# EasyEDA Pro project Output_Register.eprj

# Schematic Schematic1
Board Name: Board1; Create Date: 2025-08-19; Page Name: P1; Project Name: Output_Register; Schematic Name: Schematic1; Update Date: 2025-08-19; Company: EasyEDA.com; Page Size: A4; Version: V1.0
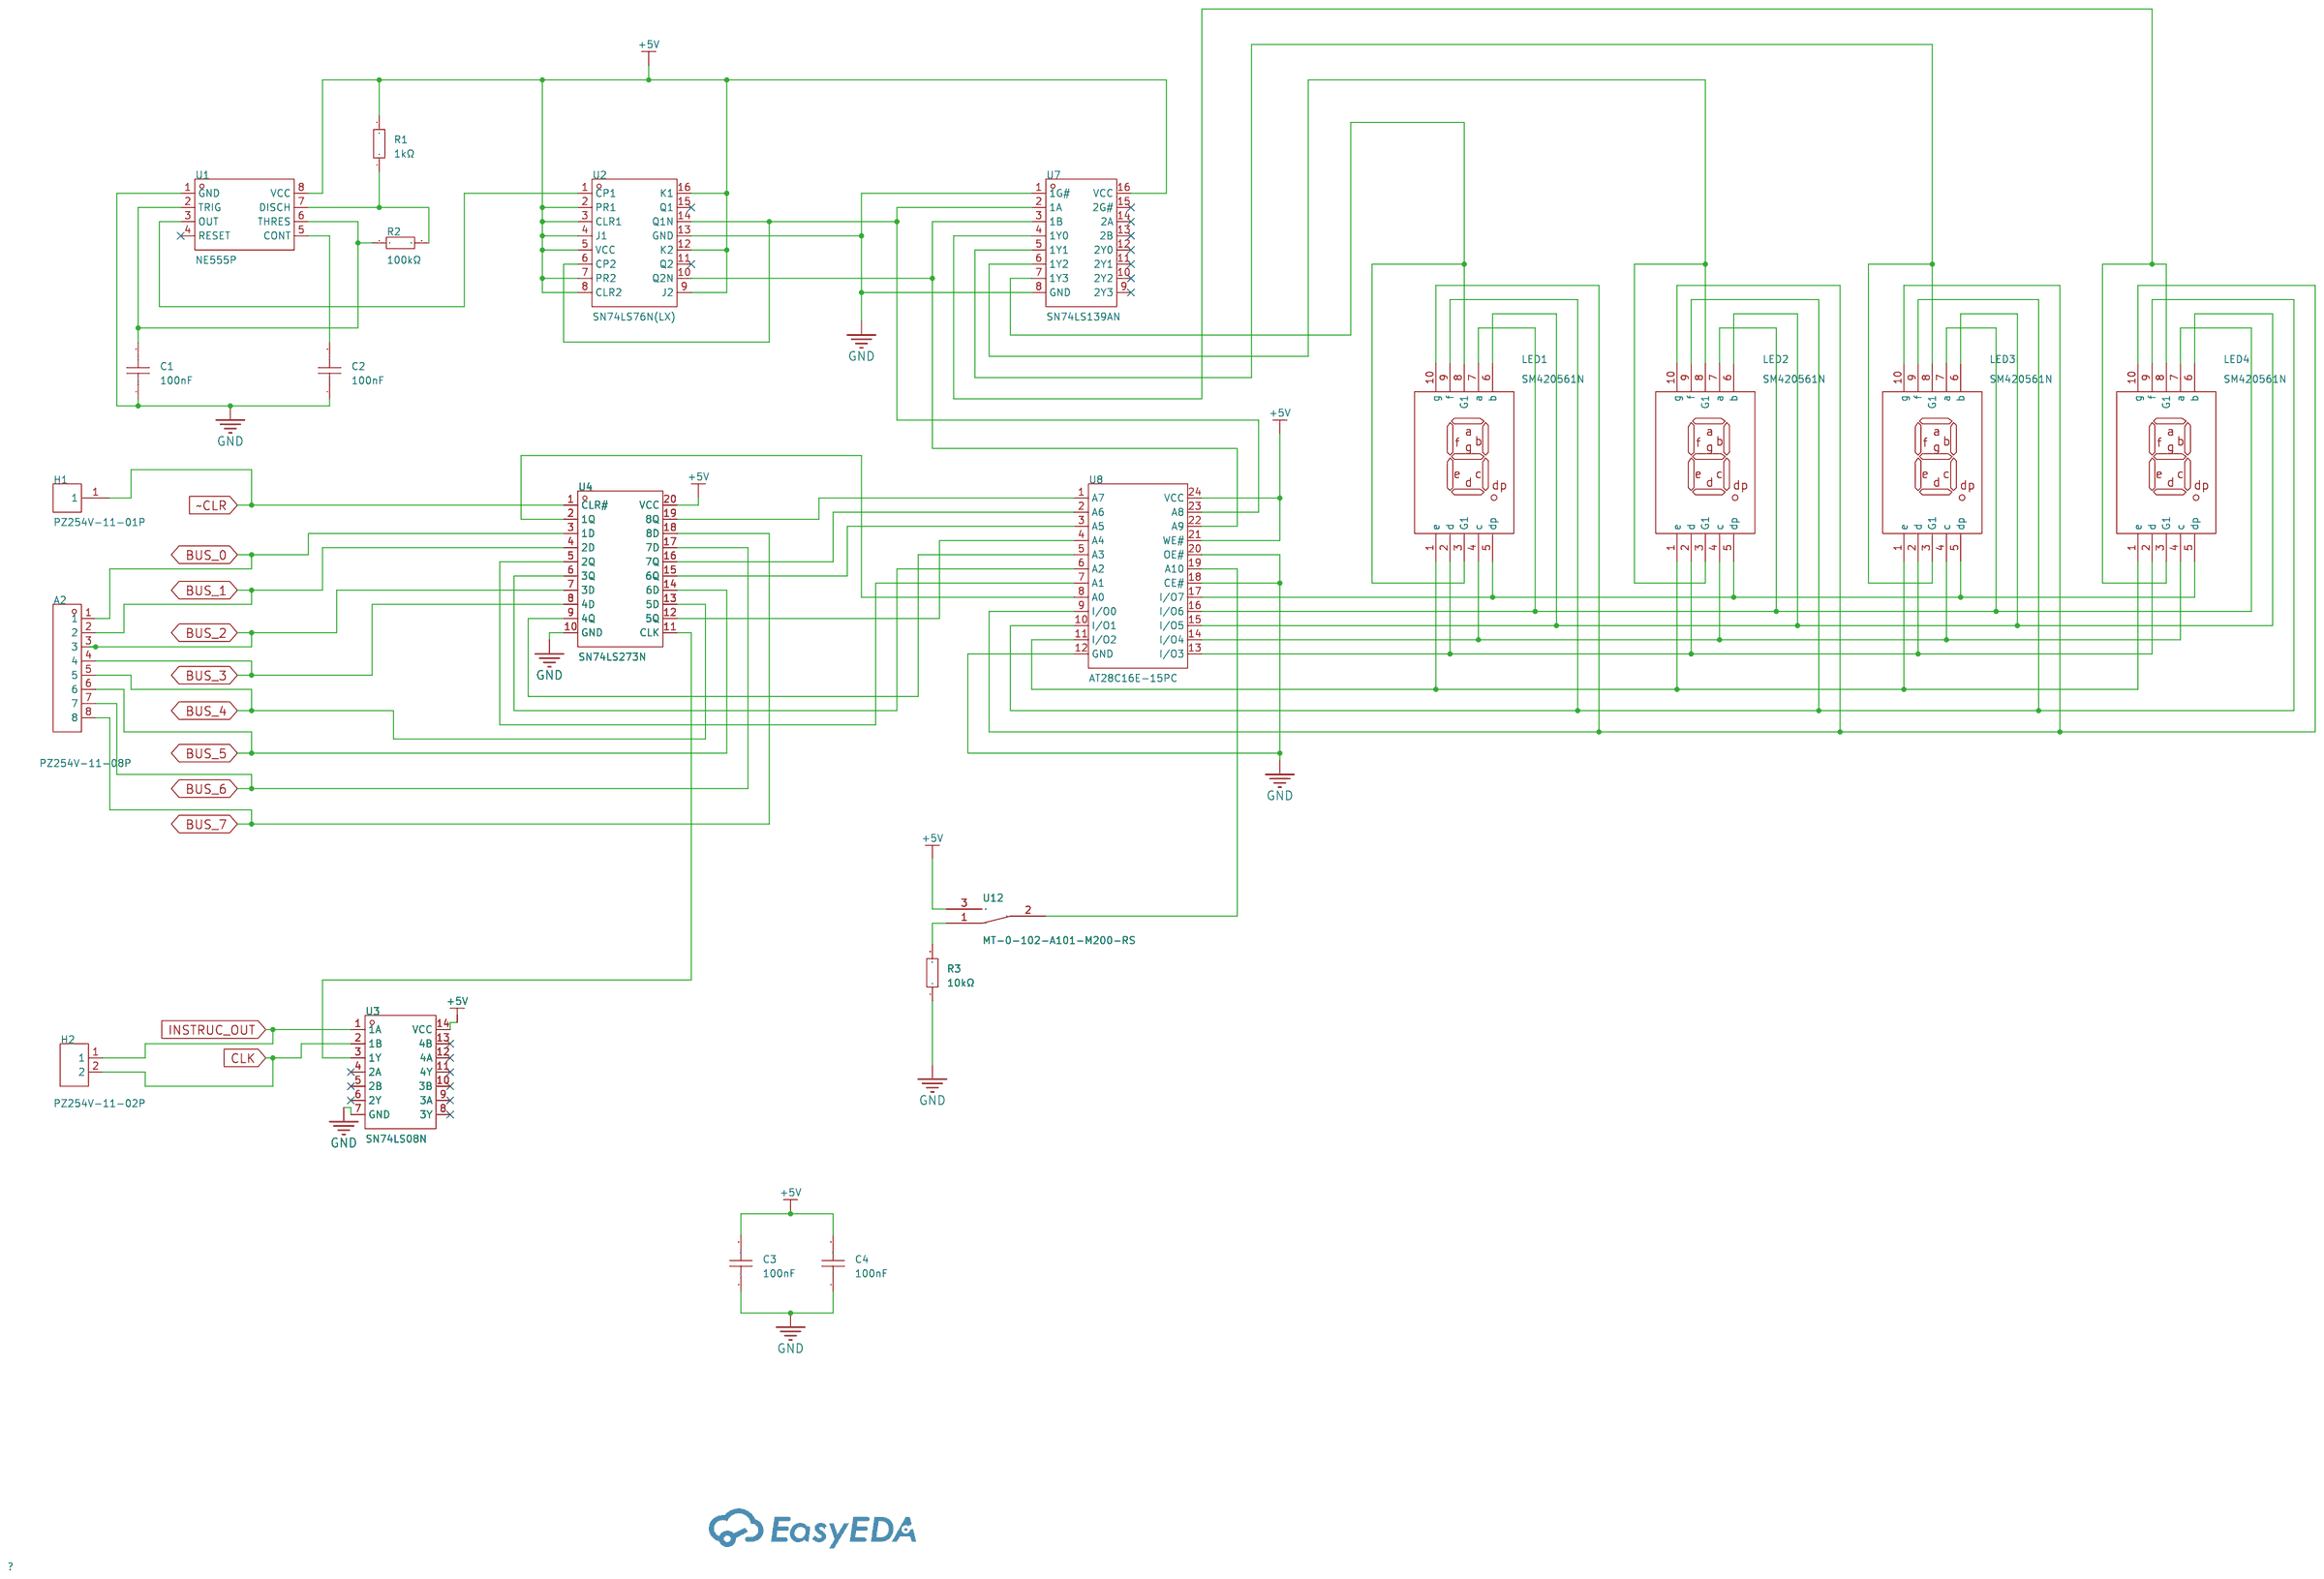
[diagram p0: schematic sheet]

## Parts
A2  PZ254V-11-08P  [HDR-TH_8P-P2.54-V-M]
C1  100nF  [CAP-TH_L8.5-W5.0-P5.00-D1.2]
C2  100nF  [CAP-TH_L8.5-W5.0-P5.00-D1.2]
C3  100nF  [CAP-TH_L8.5-W5.0-P5.00-D1.2]
C4  100nF  [CAP-TH_L8.5-W5.0-P5.00-D1.2]
H1  PZ254V-11-01P  [HDR-TH_1P-P2.54-V-M]
H2  PZ254V-11-02P  [HDR-TH_2P-P2.54-V-M]
LED1  SM420561N  [LED-SEG-TH_10P-L12.7-W19.0-P2.54-S15.24-BL]
LED2  SM420561N  [LED-SEG-TH_10P-L12.7-W19.0-P2.54-S15.24-BL]
LED3  SM420561N  [LED-SEG-TH_10P-L12.7-W19.0-P2.54-S15.24-BL]
LED4  SM420561N  [LED-SEG-TH_10P-L12.7-W19.0-P2.54-S15.24-BL]
R1  1kΩ  [R_AXIAL-0.4]
R2  100kΩ  [R_AXIAL-0.4]
R3  10kΩ  [R_AXIAL-0.4]
U1  NE555P  [DIP-8_L9.8-W6.6-P2.54-LS7.6-BL]
U2  SN74LS76N(LX)  [PDIP-16_L19.3-W6.4-P2.54-LS7.94-BL]
U3  SN74LS08N  [PDIP-14_L19.3-W6.4-P2.54-LS7.9-BL-1]
U4  SN74LS273N  [PDIP-20_L25.4-W6.4-P2.54-LS7.6-BL]
U7  SN74LS139AN  [PDIP-16_L19.3-W6.4-P2.54-LS7.9-BL]
U8  AT28C16E-15PC  [PDIP-24_L31.0-W13.5-P2.54-LS15.2-BL]
U12  MT-0-102-A101-M200-RS  [SW-TH_MT-0-103-A101-M200-RS]

## Library data of the parts
A2 = PZ254V-11-08P: Pin Structure:1x8P Pitch:2.54mm Row Spacing:- Circluar Pins/Square Pins:Square Pins Mounting Type:Straight Number of Rows:Plugin Number of Pins:8P Current Rating (Max):- Voltage Rating (Max):- Length of Mating Pin:6mm Insulation Height:2.5mm Length of End; LCSC Part Name: 间距:2.54mm 1x8P 直插 方针; Supplier Part: C492407; Manufacturer: XFCN(兴飞); Supplier Footprint: 插件,P=2.54mm; JLCPCB Part Class: Extended Part; Datasheet: https://atta.szlcsc.com/upload/public/pdf/source/20200309/C492407_83A6FB26A2233368EDB9516968EC6149.pdf; Supplier: LCSC; Pin Structure: 1x8P; Pitch: 2.54mm; Circluar Pins/Square Pins: Square Pins; Mounting Type: Straight; Number of Rows: Plugin; Number of Pins: 8P; Length of Mating Pin: 6mm; Insulation Height: 2.5mm; Length of End Connection Pin: 3mm; Operating Temperature Range: -40℃~+105℃; Color: Black
C1-C4 = CT4-0805B104K500F3: Capacitance:100nF Tolerance:±10% Tolerance:±10% Voltage Rated: Temperature Coefficient:; LCSC Part Name: 100nF ±10% 50V C3型（直脚）; Supplier Part: C84772; Manufacturer: FH(风华); Supplier Footprint: 插件,P=5.08mm; JLCPCB Part Class: Extended Part; Datasheet: https://atta.szlcsc.com/upload/public/pdf/source/20190402/C385200_059806A6312B28FF1421A2413EB641E1.pdf; Supplier: LCSC; Tolerance: ±10%
H1 = PZ254V-11-01P: Pin Structure:1x1P Pitch:2.54mm Row Spacing:- Circluar Pins/Square Pins:Policy Mounting Type:Straight Number of Rows:Single Row Number of Pins:1P Current Rating:- Voltage Rating (Max):- Length of Mating Pin:6mm Insulation Height:2.5mm Length of End Connec; LCSC Part Name: 1x1P 间距:2.54mm 方针 直插; Supplier Part: C492400; Manufacturer: XFCN(兴飞); Supplier Footprint: 插件,P=2.54mm; JLCPCB Part Class: Extended Part; Datasheet: https://atta.szlcsc.com/upload/public/pdf/source/20200309/C492400_46876A5B545F5AE6B8D4A09C46E276E8.pdf; Supplier: LCSC; Pin Structure: 1x1P; Pitch: 2.54mm; Circluar Pins/Square Pins: Policy; Mounting Type: Straight; Number of Rows: Single Row; Number of Pins: 1P; Length of Mating Pin: 6mm; Insulation Height: 2.5mm; Length of End Connection Pin: 3mm; Contact Material: Brass; Operating Temperature: -40℃~+105℃; Color: Black
H2 = PZ254V-11-02P: Pin Structure:1x2P Pitch:2.54mm Row Spacing:- Circluar Pins/Square Pins:Policy Mounting Type:Straight Number of Rows:Single Row Number of Pins:2P Current Rating:- Voltage Rating (Max):- Length of Mating Pin:6mm Insulation Height:2.5mm Length of End Connec; LCSC Part Name: 1x2P 间距:2.54mm 方针 直插; Supplier Part: C492401; Manufacturer: XFCN(兴飞); Supplier Footprint: 插件,P=2.54mm; JLCPCB Part Class: Extended Part; Datasheet: https://atta.szlcsc.com/upload/public/pdf/source/20200309/C492401_A812433581A9B211A7FFA413ADDFF0E5.pdf; Supplier: LCSC; Pin Structure: 1x2P; Pitch: 2.54mm; Circluar Pins/Square Pins: Policy; Mounting Type: Straight; Number of Rows: Single Row; Number of Pins: 2P; Length of Mating Pin: 6mm; Insulation Height: 2.5mm; Length of End Connection Pin: 3mm; Contact Material: Brass; Operating Temperature: -40℃~+105℃; Color: Black
LED1-LED4 = SM420561N: Number of Characters:1Bit Display Type:7段 Module Size:19mmx12.6mmx8mm Power Dissipation:50mW Luminous Color:Red LED Polarity:共阴极 Digit/Alpha Size(inch):0.56; LCSC Part Name: 1位0.56英寸红色数码管 共阴极; Supplier Part: C141367; Manufacturer: ARKLED(方舟); Supplier Footprint: 插件; JLCPCB Part Class: Extended Part; Datasheet: https://atta.szlcsc.com/upload/public/pdf/source/20171116/C141367_15108221483041123770.pdf; Supplier: LCSC; Number of Characters: 1Bit; Display Type: 7段; Module Size: 19mmx12.6mmx8mm; Power Dissipation: 50mW; Luminous Color: Red; LED Polarity: 共阴极; Digit/Alpha Size(inch): 0.56
R1-R3 = Res_AXIAL-1/4W: Supplier Footprint: Through
U1 = NE555P: Supplier Part: C46749; Manufacturer: TI(德州仪器); Supplier Footprint: DIP-8; JLCPCB Part Class: Extended Part; Datasheet: https://www.ti.com/cn/lit/gpn/ne555; Supplier: LCSC
U2 = SN74LS76N(LX): Type:JK-Type Trigger Type:Falling Edge Voltage - Supply:2V~6V Voltage - Supply:2V~6V Clock Frequency:28MHz Output Type:Push-Pull Propagation Delay:- Series:74LS Series Quiescent Current:2uA Operating Temperature:-40℃~+125℃ Operating Temperature:-40℃~+125℃; Supplier Part: C41432856; Manufacturer: LX(灵星芯微); Supplier Footprint: DIP-16; Datasheet: https://atta.szlcsc.com/upload/public/pdf/source/20241021/03E57047579D06EC809D279D7674BE8E.pdf; Supplier: LCSC; Type: JK-Type; Trigger Type: Falling Edge; Voltage - Supply: 2V~6V; Clock Frequency: 28MHz; Output Type: Push-Pull; Series: 74LS Series; Quiescent Current: 2uA; Operating Temperature: -40℃~+125℃
U3 = SN74LS08N: Logic Type:AND Gate Number of Channels:4 Voltage - Supply:4.75V~5.25V Voltage - Supply:4.75V~5.25V Current - Output Low(IOL):8mA Current - Output High(IOH):400uA Input Logic Level - High:2V Input Logic Level - High:2V Input Logic Level - Low:800mV Input L; Supplier Part: C2869595; Manufacturer: TI(德州仪器); Supplier Footprint: PDIP-14; JLCPCB Part Class: Extended Part; Datasheet: https://www.ti.com/cn/lit/gpn/sn54s08; Supplier: LCSC; Logic Type: AND Gate; Number of Channels: 4; Voltage - Supply: 4.75V~5.25V; Current - Output Low(IOL): 8mA; Current - Output High(IOH): 400uA; Input Logic Level - High: 2V; Input Logic Level - Low: 800mV; Series: 74LSSeries; Operating Temperature: 0℃~+70℃
U4 = SN74LS273N: Type:D-Type Trigger Type:Rising Edge Voltage - Supply:4.75V~5.25V Voltage - Supply:4.75V~5.25V Clock Frequency:40MHz Function:Reset Number of Elements:1 Number of Bits per Element:8 Output Type:- Propagation Delay:27ns@5V,15pF Series:74LS Series Current -; Supplier Part: C2879026; Manufacturer: TI(德州仪器); Supplier Footprint: PDIP-20; JLCPCB Part Class: Extended Part; Datasheet: https://www.ti.com/cn/lit/gpn/sn54ls273; Supplier: LCSC; Type: D-Type; Trigger Type: Rising Edge; Voltage - Supply: 4.75V~5.25V; Clock Frequency: 40MHz; Function: Reset; Number of Elements: 1; Number of Bits per Element: 8; Propagation Delay: 27ns@5V,15pF; Series: 74LS Series; Current - Output Low(IOL): 8mA; Current - Output High(IOH): 400uA; Quiescent Current: 27mA; Operating Temperature: 0℃~+70℃
U7 = SN74LS139AN: Type:Decoder/Demultiplexer Voltage Supply Source:Single Supply Voltage - Supply:4.75V~5.25V Voltage - Supply:4.75V~5.25V Current - Output Low(IOL):8mA Current - Output High(IOH):400uA Operating temperature:0℃~+70℃ Operating temperature:0℃~+70℃; Supplier Part: C1547281; Manufacturer: TI(德州仪器); Supplier Footprint: PDIP-16; JLCPCB Part Class: Extended Part; Datasheet: https://www.ti.com/cn/lit/gpn/sn74ls139a; Supplier: LCSC; Type: Decoder/Demultiplexer; Voltage Supply Source: Single Supply; Voltage - Supply: 4.75V~5.25V; Current - Output Low(IOL): 8mA; Current - Output High(IOH): 400uA; Operating temperature: 0℃~+70℃
U8 = AT28C16E-15PC: Supplier Part: C19393057; Manufacturer: MICROCHIP(美国微芯); Supplier Footprint: PDIP-24; JLCPCB Part Class: Extended Part; Datasheet: https://atta.szlcsc.com/upload/public/pdf/source/20231219/98B154FA288F53C07025EE50A49045E4.pdf; Supplier: LCSC
U12 = MT-0-102-A101-M200-RS: Circuit:Single Pole Double Throw (SPDT) Switch Length:13mm Switch Width:8mm Switch Height:28.6mm Mechanical Life:- Contact Current:5A Voltage Rating (AC):125V Actuator Type:Cylinder knob Pin Style:Solder Mounting Style:Direct Insert Operating Temperature:; LCSC Part Name: 小型钮子三脚二档 五件套; Supplier Part: C1788492; Manufacturer: YUEN FUNG(源丰); Supplier Footprint: 插件; JLCPCB Part Class: Extended Part; Datasheet: https://atta.szlcsc.com/upload/public/pdf/source/20230720/8E5C36EFDF374AE4FF4AC09DB233CE0E.pdf; Supplier: LCSC; Circuit: Single Pole Double Throw (SPDT); Switch Length: 13mm; Switch Width: 8mm; Switch Height: 28.6mm; Contact Current: 5A; Voltage Rating (AC): 125V; Actuator Type: Cylinder knob; Pin Style: Solder; Mounting Style: Direct Insert; Operating Temperature: -25℃~+85℃

## Nets
+5V: C3.2 C4.2 R1.2 U1.8(VCC) U2.2(PR1) U2.3(CLR1) U2.4(J1) U2.5(VCC) U2.7(PR2) U2.8(CLR2) U2.9(J2) U2.12(K2) U2.16(K1) U3.14(VCC) U4.20(VCC) U7.16(VCC) U8.21(WE#) U8.24(VCC) U12.3
GND: C1.1 C2.1 C3.1 C4.1 R3.1 U1.1(GND) U2.13(GND) U3.7(GND) U4.10(GND) U7.1(1G#) U7.8(GND) U8.12(GND) U8.18(CE#) U8.20(OE#)
BUS_0: A2.1 U4.3(1D)
BUS_1: A2.2 U4.4(2D)
BUS_2: A2.3 U4.7(3D)
BUS_3: A2.4 U4.8(4D)
BUS_4: A2.5 U4.13(5D)
BUS_5: A2.6 U4.14(6D)
BUS_6: A2.7 U4.17(7D)
BUS_7: A2.8 U4.18(8D)
CLK: H2.2 U3.2(1B)
INSTRUC_OUT: H2.1 U3.1(1A)
~CLR: H1.1 U4.1(CLR#)
$1N1467: C2.2 U1.5(CONT)
$1N1468: C1.2 R2.1 U1.2(TRIG) U1.6(THRES)
$1N1469: R1.1 R2.2 U1.7(DISCH)
$1N1471: U1.3(OUT) U2.1(CP1)
$1N1472: U2.10(Q2N) U7.3(1B) U8.22(A9)
$1N1473: U2.6(CP2) U2.14(Q1N) U7.2(1A) U8.23(A8)
$1N1480: U3.3(1Y) U4.11(CLK)
$1N1483: U4.2(1Q) U8.8(A0)
$1N1484: U4.5(2Q) U8.7(A1)
$1N1485: U4.6(3Q) U8.6(A2)
$1N1486: U4.9(4Q) U8.5(A3)
$1N1487: U4.12(5Q) U8.4(A4)
$1N1488: U4.15(6Q) U8.3(A5)
$1N1489: U4.16(7Q) U8.2(A6)
$1N1490: U4.19(8Q) U8.1(A7)
$1N1495: LED1.10(g) LED2.10(g) LED3.10(g) LED4.10(g) U8.9(I/O0)
$1N1496: LED1.9(f) LED2.9(f) LED3.9(f) LED4.9(f) U8.10(I/O1)
$1N1497: LED1.1(e) LED2.1(e) LED3.1(e) LED4.1(e) U8.11(I/O2)
$1N1498: LED1.2(d) LED2.2(d) LED3.2(d) LED4.2(d) U8.13(I/O3)
$1N1499: LED1.4(c) LED2.4(c) LED3.4(c) LED4.4(c) U8.14(I/O4)
$1N1500: LED1.6(b) LED2.6(b) LED3.6(b) LED4.6(b) U8.15(I/O5)
$1N1501: LED1.7(a) LED2.7(a) LED3.7(a) LED4.7(a) U8.16(I/O6)
$1N1502: LED1.5(dp) LED2.5(dp) LED3.5(dp) LED4.5(dp) U8.17(I/O7)
$1N1503: LED3.3(G1) LED3.8(G1) U7.5(1Y1)
$1N1504: LED2.3(G1) LED2.8(G1) U7.6(1Y2)
$1N1505: LED1.3(G1) LED1.8(G1) U7.7(1Y3)
$1N1506: LED4.3(G1) LED4.8(G1) U7.4(1Y0)
$1N1511: R3.2 U12.1
$1N1512: U8.19(A10) U12.2

Not connected (* = marked no-connect by the designer): U1 4(RESET)*; U2 11(Q2)* 15(Q1)*; U3 4(2A)* 5(2B)* 6(2Y)* 8(3Y)* 9(3A)* 10(3B)* 11(4Y)* 12(4A)* 13(4B)*; U7 9(2Y3)* 10(2Y2)* 11(2Y1)* 12(2Y0)* 13(2B)* 14(2A)* 15(2G#)*

# Board PCB1
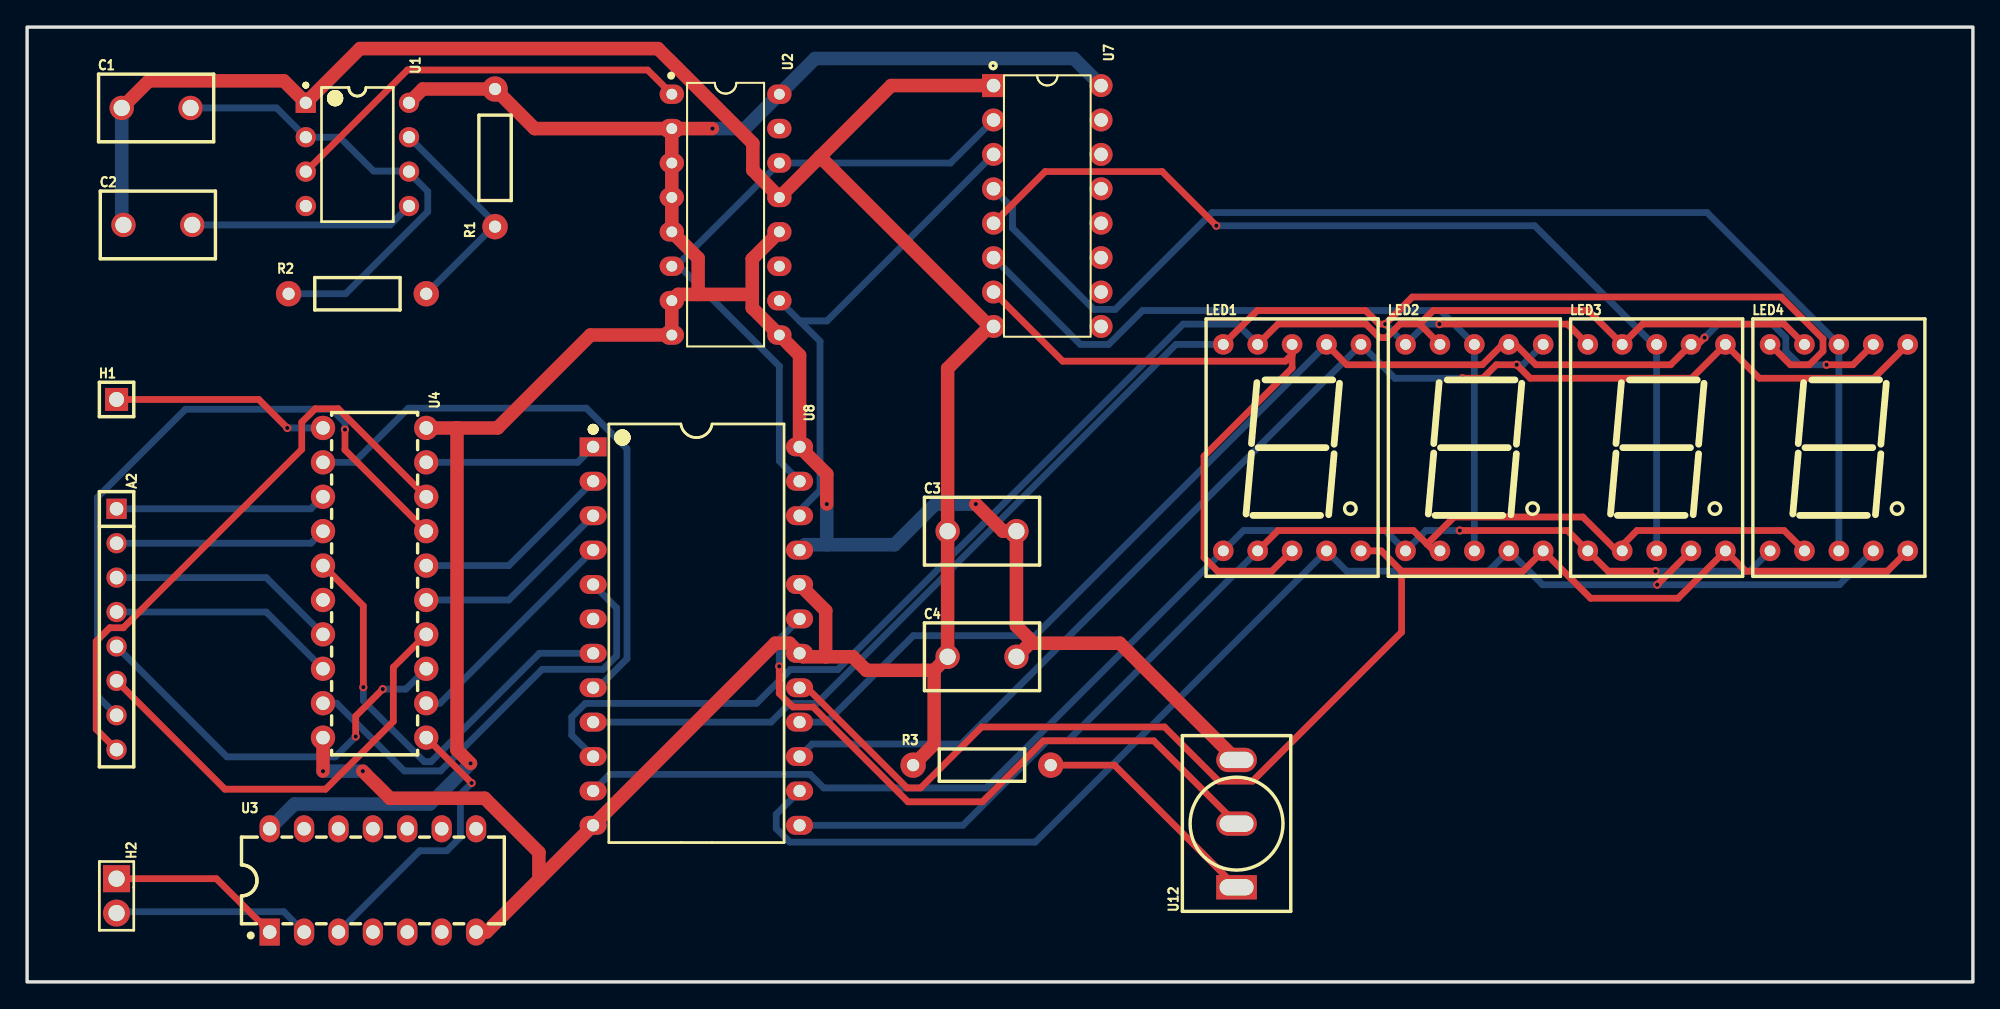
[diagram p1: board, top side]
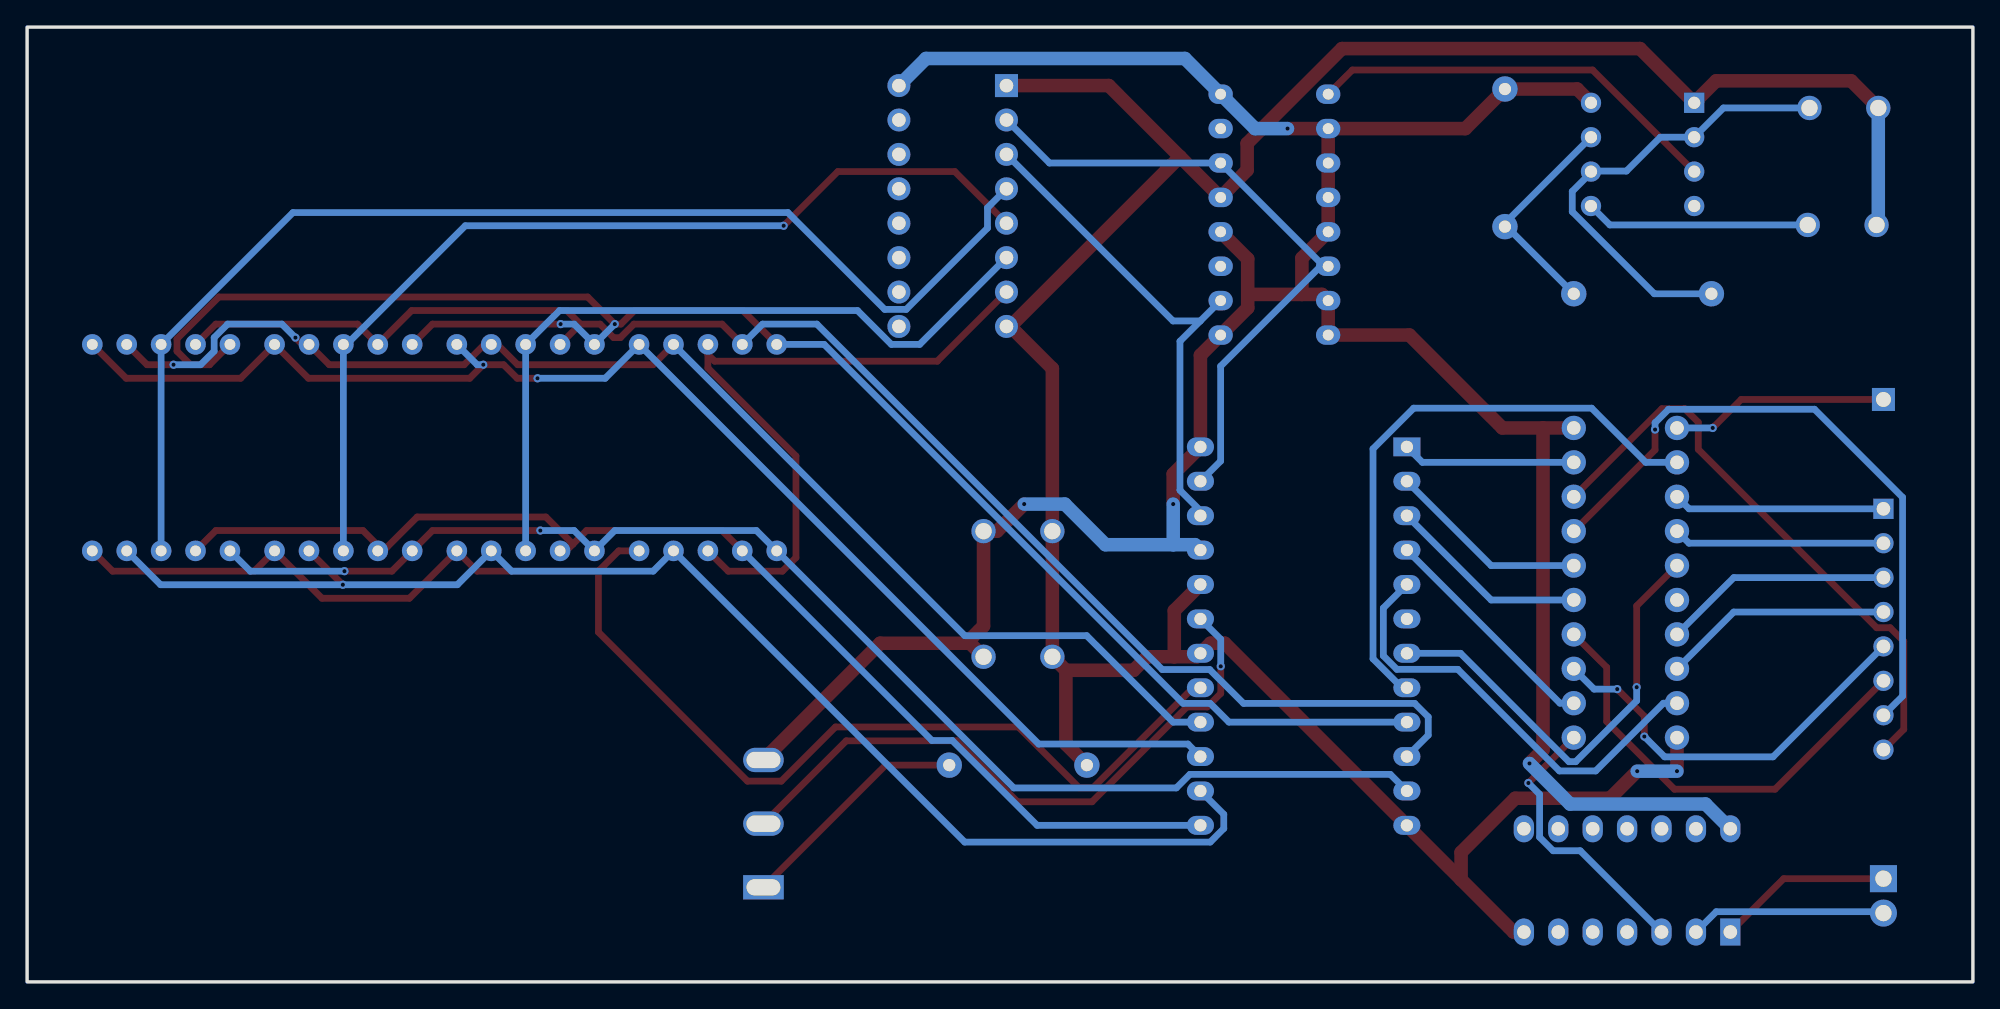
[diagram p2: board, bottom side, seen from below]

Outline 143.64 x 70.48 mm; copper layers: Top Layer, Bottom Layer. Coordinates in mm from the lower left corner of the outline.
Outline path: rectangle 0,70.48 143.64,0
Stack: Top Layer 0.035mm / Dielectric1 1.51mm FR4 er 4.5 / Bottom Layer 0.035mm

## Design rules (mm)
template: Custom Config
spacing copperThickness1oz (default): track to track 0.102, other pairs 0.152 to 0.3
spacing copperThickness2oz: track to track 0.203, other pairs 0.152 to 0.3
track width copperThickness1oz (default): min 0.127, default 0.5, max 2.54
track width copperThickness2oz: min 0.203, default 1, max 2.54
differential pair differentialPair (default): width min 0.127, default 0.254, max 2.54; gap min 0.152, default 0.152
via viaSize (default): diameter min 0.5, default 0.61, max 10; hole min 0.3, default 0.305, max 6.3
net GND uses copperThickness2oz
net +5V uses copperThickness2oz

## Placement (name value [footprint] x y rotation side)
A2  PZ254V-11-08P  [HDR-TH_8P-P2.54-V-M]  6.6 26.04 270 top
C1  100nF  [CAP-TH_L8.5-W5.0-P5.00-D1.2]  9.53 64.52 0 top
C2  100nF  [CAP-TH_L8.5-W5.0-P5.00-D1.2]  9.65 55.88 0 top
C3  100nF  [CAP-TH_L8.5-W5.0-P5.00-D1.2]  70.49 33.27 0 top
C4  100nF  [CAP-TH_L8.5-W5.0-P5.00-D1.2]  70.49 24 0 top
H1  PZ254V-11-01P  [HDR-TH_1P-P2.54-V-M]  6.6 43 0 top
H2  PZ254V-11-02P  [HDR-TH_2P-P2.54-V-M]  6.6 6.35 270 top
LED1  SM420561N  [LED-SEG-TH_10P-L12.7-W19.0-P2.54-S15.24-BL]  93.38 39.44 0 top
LED2  SM420561N  [LED-SEG-TH_10P-L12.7-W19.0-P2.54-S15.24-BL]  106.83 39.44 0 top
LED3  SM420561N  [LED-SEG-TH_10P-L12.7-W19.0-P2.54-S15.24-BL]  120.29 39.44 0 top
LED4  SM420561N  [LED-SEG-TH_10P-L12.7-W19.0-P2.54-S15.24-BL]  133.74 39.44 0 top
R1  1kΩ  [R_AXIAL-0.4]  34.54 60.83 90 top
R2  100kΩ  [R_AXIAL-0.4]  24.38 50.8 0 top
R3  10kΩ  [R_AXIAL-0.4]  70.48 16 0 top
U1  NE555P  [DIP-8_L9.8-W6.6-P2.54-LS7.6-BL]  24.38 61.09 270 top
U2  SN74LS76N(LX)  [PDIP-16_L19.3-W6.4-P2.54-LS7.94-BL]  51.56 56.64 270 top
U3  SN74LS08N  [PDIP-14_L19.3-W6.4-P2.54-LS7.9-BL-1]  25.53 7.49 0 top
U4  SN74LS273N  [PDIP-20_L25.4-W6.4-P2.54-LS7.6-BL]  25.65 29.46 270 top
U7  SN74LS139AN  [PDIP-16_L19.3-W6.4-P2.54-LS7.9-BL]  75.31 57.28 270 top
U8  AT28C16E-15PC  [PDIP-24_L31.0-W13.5-P2.54-LS15.2-BL]  49.4 25.53 270 top
U12  MT-0-102-A101-M200-RS  [SW-TH_MT-0-103-A101-M200-RS]  89.28 11.68 90 top

## Footprints (pads in the part's own frame, mm; a bottom-side part is the same pattern mirrored in y, then rotated)
CAP-TH_L8.5-W5.0-P5.00-D1.2
  round 1.8 hole 1.2: 1(-2.54,0) 2(2.54,0)
DIP-8_L9.8-W6.6-P2.54-LS7.6-BL
  rect 1.5x1.5 hole 0.9: 1(-3.81,-3.81)
  round 1.5 hole 0.9: 2(-1.27,-3.81) 3(1.27,-3.81) 4(3.81,-3.81) 5(3.81,3.81) 6(1.27,3.81) 7(-1.27,3.81) 8(-3.81,3.81)
HDR-TH_1P-P2.54-V-M
  rect 1.7x1.7 hole 1.1: 1(0,0)
HDR-TH_2P-P2.54-V-M
  rect 2x2 hole 1.2: 1(-1.27,0)
  round 2 hole 1.2: 2(1.27,0)
HDR-TH_8P-P2.54-V-M
  rect 1.5x1.5 hole 1: 1(-8.89,0)
  round 1.5 hole 1: 2(-6.35,0) 3(-3.81,0) 4(-1.27,0) 5(1.27,0) 6(3.81,0) 7(6.35,0) 8(8.89,0)
LED-SEG-TH_10P-L12.7-W19.0-P2.54-S15.24-BL
  round 1.524 hole 0.8: 1(-5.08,-7.62) 2(-2.54,-7.62) 3(0,-7.62) 4(2.54,-7.62) 5(5.08,-7.62) 6(5.08,7.62) 7(2.54,7.62) 8(0,7.62) 9(-2.54,7.62) 10(-5.08,7.62)
PDIP-14_L19.3-W6.4-P2.54-LS7.9-BL-1
  rect 1.5x2 hole 1: 1(-7.62,-3.809)
  oval 1.5x2 hole 1: 2(-5.08,-3.81) 3(-2.54,-3.81) 4(0,-3.81) 5(2.54,-3.81) 6(5.08,-3.81) 7(7.62,-3.81) 8(7.62,3.81) 9(5.08,3.81) 10(2.54,3.81) 11(0,3.81) 12(-2.54,3.81) 13(-5.08,3.81) 14(-7.62,3.81)
PDIP-16_L19.3-W6.4-P2.54-LS7.9-BL
  rect 1.7x1.7 hole 1: 1(-8.89,-3.97)
  round 1.7 hole 1: 2(-6.35,-3.97) 3(-3.81,-3.97) 4(-1.27,-3.97) 5(1.27,-3.97) 6(3.81,-3.97) 7(6.35,-3.97) 8(8.89,-3.97) 9(8.89,3.97) 10(6.35,3.97) 11(3.81,3.97) 12(1.27,3.97) 13(-1.27,3.97) 14(-3.81,3.97) 15(-6.35,3.97) 16(-8.89,3.97)
PDIP-16_L19.3-W6.4-P2.54-LS7.94-BL
  oval 1.44x1.8 hole 0.8: 1(-8.89,-3.97) 2(-6.35,-3.97) 3(-3.81,-3.97) 4(-1.27,-3.97) 5(1.27,-3.97) 6(3.81,-3.97) 7(6.35,-3.97) 8(8.89,-3.97) 9(8.89,3.97) 10(6.35,3.97) 11(3.81,3.97) 12(1.27,3.97) 13(-1.27,3.97) 14(-3.81,3.97) 15(-6.35,3.97) 16(-8.89,3.97)
PDIP-20_L25.4-W6.4-P2.54-LS7.6-BL
  round 1.8 hole 1: 1(-11.43,-3.81) 2(-8.89,-3.81) 3(-6.35,-3.81) 4(-3.81,-3.81) 5(-1.27,-3.81) 6(1.27,-3.81) 7(3.81,-3.81) 8(6.35,-3.81) 9(8.89,-3.81) 10(11.43,-3.81) 11(11.43,3.81) 12(8.89,3.81) 13(6.35,3.81) 14(3.81,3.81) 15(1.27,3.81) 16(-1.27,3.81) 17(-3.81,3.81) 18(-6.35,3.81) 19(-8.89,3.81) 20(-11.43,3.81)
PDIP-24_L31.0-W13.5-P2.54-LS15.2-BL
  rect 1.4x2 hole 0.9: 1(-13.97,-7.62)
  oval 1.4x2 hole 0.9: 2(-11.43,-7.62) 3(-8.89,-7.62) 4(-6.35,-7.62) 5(-3.81,-7.62) 6(-1.27,-7.62) 7(1.27,-7.62) 8(3.81,-7.62) 9(6.35,-7.62) 10(8.89,-7.62) 11(11.43,-7.62) 12(13.97,-7.62) 13(13.97,7.62) 14(11.43,7.62) 15(8.89,7.62) 16(6.35,7.62) 17(3.81,7.62) 18(1.27,7.62) 19(-1.27,7.62) 20(-3.81,7.62) 21(-6.35,7.62) 22(-8.89,7.62) 23(-11.43,7.62) 24(-13.97,7.62)
R_AXIAL-0.4
  round 1.879 hole 0.899: 1(-5.08,0) 2(5.08,0)
SW-TH_MT-0-103-A101-M200-RS
  rect 1.8x3 hole 1.2x2.5: 1(-4.7,0)
  oval 1.8x3 hole 1.2x2.5: 2(0,0) 3(4.7,0)

## Nets
As in the schematic.

Pads without a net: U1 4; U2 11 15; U3 4 5 6 8 9 10 11 12 13; U7 9 10 11 12 13 14 15

## Via types
v1: diameter 0.61, hole 0.305, Top Layer to Bottom Layer, 23 vias

## Routing (per net, layer and track width the routed paths; a pad name or vN(x,y) marks a point on that pad's centre or on a via; arc(x,y) is an arc through that point)
+5V: length 213.7
  Top Layer w1: 49.53,50.75 49.53,53.43 47.59,55.37 U2.4 U2.3 U2.2 ; 49.53,50.75 48.05,50.75 47.59,50.29 U2.8 41.59,47.75 34.73,40.89 31.73,40.89 ; 49.53,50.75 53.53,50.75 ; v1(32.73,16.13) 31.73,17.13 31.73,40.89 ; U2.2 v1(50.59,62.99) ; U2.2 37.47,62.99 R1.2 29.21,65.91 U1.8 ; 53.53,50.75 53.53,49.75 U2.9 57.02,46.26 U8.24 59.03,37.49 v1(59.03,35.27) ; 53.53,50.75 53.53,53.37 55.53,55.37 ; 74.03,25 C4.2 ; 74.03,25 80.66,25 U12.3 ; 74.03,25 74.03,25.27 73.03,26.27 C3.2 72.03,33.27 v1(70.03,35.27) ; 31.73,40.89 U4.20
  Bottom Layer w1: 59.03,32.27 57.42,32.27 U8.21 ; 59.03,32.27 v1(59.03,35.27) ; 59.03,32.27 64.03,32.27 67.03,35.27 v1(70.03,35.27) ; v1(50.59,62.99) 52.99,62.99 U2.16 58.17,68.17 77.28,68.17 U7.16 ; U3.14 19.73,13.13 29.73,13.13 v1(32.73,16.13)
GND: length 210.6
  Top Layer w1: v1(21.84,15.56) U4.10 ; 37.78,7.56 U8.12 55.23,25 56.28,25 57.28,24 58.95,24 ; 37.78,7.56 37.78,9.56 33.78,13.56 26.78,13.56 v1(24.78,15.56) ; 37.78,7.56 33.91,3.68 U3.7 ; 66.95,23 C4.1 C3.1 67.95,45.28 71.06,48.39 ; 66.95,23 66.95,17.55 R3.1 ; 66.95,23 61.95,23 60.95,24 58.95,24 ; U7.1 63.79,66.17 58.53,60.91 ; 58.53,60.91 71.06,48.39 ; 58.53,60.91 U2.13 53.57,59.93 53.57,61.9 46.57,68.9 24.57,68.9 U1.1 18.95,66.52 8.98,66.52 C1.1 ; 71.06,48.39 U7.8 ; 58.95,24 58.95,27.41 U8.20
  Bottom Layer w1: 7.11,55.88 6.98,56.01 C1.1 ; v1(24.78,15.56) v1(21.84,15.56)
BUS_0: length 15.6
  Bottom Layer w0.5: A2.1 20.95,34.93 U4.3
BUS_1: length 15.6
  Bottom Layer w0.5: A2.2 20.95,32.39 U4.4
BUS_2: length 17
  Bottom Layer w0.5: U4.7 17.65,29.85 A2.3
BUS_3: length 17
  Bottom Layer w0.5: A2.4 17.65,27.31 U4.8
BUS_4: length 29.8
  Top Layer w0.5: v1(24.26,18.11) 24.26,19.61 v1(26.26,21.61)
  Bottom Layer w0.5: A2.5 14.76,16.61 22.76,16.61 v1(24.26,18.11) ; v1(26.26,21.61) 27.96,21.61 U4.13
BUS_5: length 33.3
  Top Layer w0.5: A2.6 14.6,14.22 22.04,14.22 27.04,19.23 27.04,23.23 U4.14
BUS_6: length 48.5
  Top Layer w0.5: v1(23.46,40.77) 23.46,39.27 U4.17
  Bottom Layer w0.5: v1(23.46,40.77) 23.46,41.27 22.46,42.27 11.69,42.27 5.19,35.77 5.19,21.1 A2.7
BUS_7: length 44
  Top Layer w0.5: A2.8 5.1,18.65 5.1,25.15 6.1,26.15 7.1,26.15 20.27,39.31 20.27,41.31 21.27,42.31 22.96,42.31 U4.18
CLK: length 14.5
  Bottom Layer w0.5: H2.2 6.71,5.18 18.95,5.18 U3.2
INSTRUC_OUT: length 12.9
  Top Layer w0.5: U3.1 13.97,7.62 H2.1
~CLR: length 16.1
  Top Layer w0.5: v1(19.21,40.89) 17.1,43 H1.1
  Bottom Layer w0.5: v1(19.21,40.89) U4.1
$1N1467: length 16.6
  Bottom Layer w0.5: U1.5 26.8,55.88 C2.2
$1N1468: length 34.5
  Bottom Layer w0.5: 28.07,59.86 U1.6 ; 28.07,59.86 25.57,59.86 23.07,62.36 U1.2 18.42,64.52 C1.2 ; 28.07,59.86 29.57,58.36 29.57,56.86 23.52,50.8 R2.1
$1N1469: length 16.4
  Bottom Layer w0.5: U1.7 34.54,56.01 R1.1 34.42,55.75 R2.2
$1N1471: length 30.9
  Top Layer w0.5: U1.3 28.07,67.32 45.81,67.32 U2.1
$1N1472: length 37.1
  Bottom Layer w0.5: 55.53,50.29 57.03,48.79 ; 57.03,48.79 58.53,47.29 58.53,36.29 57.02,34.78 U8.22 ; 57.03,48.79 59.05,48.79 U7.3
$1N1473: length 47.9
  Bottom Layer w0.5: U7.2 68.17,60.45 U2.14 48.03,52.95 ; U2.6 47.71,52.95 48.03,52.95 ; 48.03,52.95 55.53,45.45 55.53,38.45 U8.23
$1N1480: length 21
  Top Layer w0.5: v1(32.81,14.68) U4.11
  Bottom Layer w0.5: U3.3 28.99,9.68 30.99,9.68 31.99,10.68 31.99,13.86 v1(32.81,14.68)
$1N1483: length 44.2
  Bottom Layer w0.5: U4.2 24.15,38.35 28.15,42.35 41.28,42.35 44.28,39.35 44.28,23.85 42.28,21.85 41.92,21.85 U8.8
$1N1484: length 33.3
  Top Layer w0.5: U4.5 24.82,27.76 v1(24.82,21.76)
  Bottom Layer w0.5: v1(24.82,21.76) 24.82,20.76 29.32,16.26 29.82,16.26 37.82,24.26 U8.7
$1N1486: length 33.3
  Bottom Layer w0.5: U4.9 22.84,20.57 27.84,15.57 30.52,15.57 38.02,23.07 42.52,23.07 43.52,24.07 43.52,27.6 U8.5
$1N1487: length 17
  Bottom Layer w0.5: U8.4 30.48,20.57 U4.12
$1N1488: length 14.9
  Bottom Layer w0.5: U8.3 35.56,28.19 U4.15
$1N1489: length 14.9
  Bottom Layer w0.5: U8.2 35.56,30.73 U4.16
$1N1490: length 12.8
  Bottom Layer w0.5: U8.1 40.64,38.35 U4.19
$1N1495: length 128.6
  Top Layer w0.5: LED4.10 130.16,45.56 131.57,45.56 132.57,46.56 132.57,47.47 129.48,50.56 102.26,50.56 v1(100.26,48.56) 99.8,48.56 98.8,49.56 90.8,49.56 LED1.10 ; LED3.10 113.71,48.56 v1(104.26,48.56)
  Bottom Layer w0.5: v1(100.26,48.56) LED2.10 103.26,48.56 v1(104.26,48.56) ; LED1.10 84.8,47.06 58.3,20.56 56.3,20.56 54.92,19.18 U8.9
$1N1496: length 113.5
  Top Layer w0.5: 102.8,48.56 103.8,49.56 115.25,49.56 LED3.9 119.25,48.56 129.7,48.56 LED4.9 ; 102.8,48.56 LED2.9 ; 102.8,48.56 101.34,48.56 100.34,47.56 99.84,47.56 98.84,48.56 92.34,48.56 LED1.9
  Bottom Layer w0.5: LED1.9 89.34,48.56 85.34,48.56 59.84,23.06 56.34,23.06 53.84,20.56 41.21,20.56 40.21,19.56 40.21,18.21 U8.10
$1N1497: length 98.8
  Top Layer w0.5: v1(120.21,30.32) 116.71,30.32 LED3.1 113.71,33.32 v1(105.76,33.32)
  Bottom Layer w0.5: v1(120.21,30.32) 127.16,30.32 LED4.1 ; v1(105.76,33.32) 103.26,33.32 LED2.1 100.26,33.32 89.8,33.32 LED1.1 70.8,14.32 58.8,14.32 57.8,15.32 43.01,15.32 U8.11
$1N1498: length 88.3
  Top Layer w0.5: 117.34,31.82 118.84,33.32 129.7,33.32 LED4.2 ; 117.34,31.82 114.84,34.32 105.34,34.32 103.34,32.32 ; 117.34,31.82 LED3.2 ; 103.34,32.32 102.34,33.32 92.34,33.32 LED1.2 ; 103.34,32.32 103.84,31.82 LED2.2
  Bottom Layer w0.5: U8.13 69.08,11.56 75.34,17.82 76.84,17.82 LED1.2
$1N1499: length 100.6
  Top Layer w0.5: v1(120.33,29.32) LED3.4
  Bottom Layer w0.5: LED4.4 133.78,29.32 v1(120.33,29.32) 111.88,29.32 LED2.4 107.88,30.32 97.42,30.32 LED1.4 74.42,10.32 56.3,10.32 55.3,11.32 55.3,12.37 U8.14
$1N1500: length 101.9
  Top Layer w0.5: LED4.6 136.32,44.56 127.87,44.56 LED3.6 122.87,44.56 110.96,44.56 v1(109.96,45.56) 108.46,45.56 107.46,44.56 v1(105.96,44.56)
  Bottom Layer w0.5: v1(109.96,45.56) 110.42,45.56 LED2.6 ; U8.15 57.95,17.56 68.96,17.56 LED1.6 100.96,44.56 v1(105.96,44.56)
$1N1501: length 96.4
  Top Layer w0.5: v1(123.83,47.56) 123.33,47.06 LED3.7 121.33,45.56 111.38,45.56 109.88,47.06 LED2.7 108.92,47.06 107.42,45.56 97.42,45.56 LED1.7 ; v1(132.83,45.56) 134.78,45.56 LED4.7
  Bottom Layer w0.5: U8.16 59.04,19.18 65.42,25.56 74.42,25.56 LED1.7 ; v1(132.83,45.56) 130.83,45.56 129.83,46.56 129.83,47.56 128.83,48.56 124.83,48.56 v1(123.83,47.56)
$1N1502: length 105.8
  Top Layer w0.5: LED1.5 99.96,31.82 101.46,30.32 ; U8.17 57.56,21.72 64.96,14.32 65.96,14.32 70.46,18.82 83.96,18.82 87.96,14.82 90.46,14.82 101.46,25.82 101.46,30.32 ; 101.46,30.32 110.42,30.32 LED2.5 115.42,28.32 121.87,28.32 LED3.5 126.87,30.32 137.32,30.32 LED4.5
$1N1503: length 71.2
  Top Layer w0.5: v1(87.79,55.82) 83.79,59.82 75.15,59.82 U7.5
  Bottom Layer w0.5: v1(87.79,55.82) 111.29,55.82 120.29,46.82 ; 120.29,46.82 LED3.8 ; 120.29,46.82 LED3.3
$1N1504: length 55.5
  Bottom Layer w0.5: LED2.3 LED2.8 104.33,49.56 82.33,49.56 79.83,47.06 77.75,47.06 U7.6
$1N1505: length 50.3
  Top Layer w0.5: 93.38,46.32 92.88,45.82 76.45,45.82 U7.7 ; 93.38,46.32 93.38,45.32 86.88,38.82 86.88,31.32 87.88,30.32 91.88,30.32 LED1.3 ; 93.38,46.32 LED1.8
$1N1506: length 89.2
  Bottom Layer w0.5: U7.4 72.74,57.15 72.74,55.65 78.74,49.65 80.33,49.65 87.48,56.79 124.01,56.79 LED4.8 LED4.3
$1N1511: length 17.5
  Top Layer w0.5: U12.1 80.26,16 R3.2
$1N1512: length 47.6
  Top Layer w0.5: v1(55.52,23.3) 55.52,21.3 56.52,20.3 58.02,20.3 65.02,13.3 70.52,13.3 75.02,17.8 83.17,17.8 U12.2
  Bottom Layer w0.5: v1(55.52,23.3) 55.52,25.3 U8.19
